# Altium project two_wheel_balance.PrjPcb
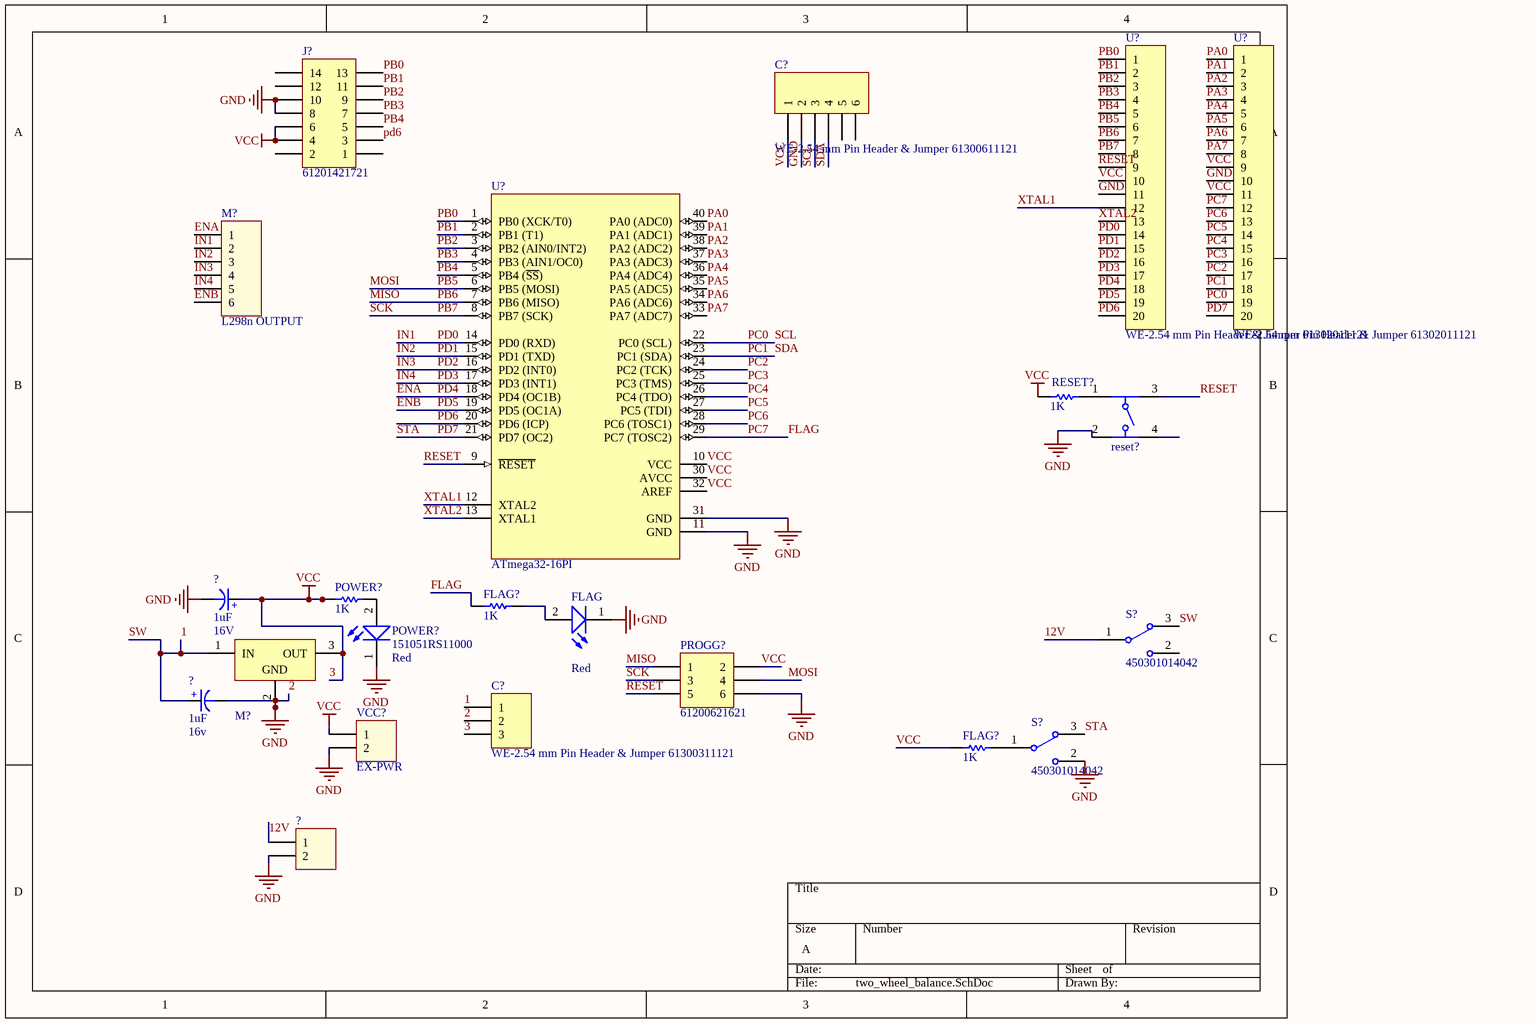
[diagram p0: two_wheel_balance.SchDoc]
1 sheet, 22 parts. Net scope: global (net labels, ports and power ports of the same name join across sheets).
Board file: TWO_WHEEL.PcbDoc

## Sheet two_wheel_balance.SchDoc
size A

### Parts
(Parts that share a designator on the sheet are numbered #1, #2 ... from top to bottom, then left to right.)
?#1  Voltage: 16V  [cap 01]  (hidden comment: 1uF)
?#2  value 1uF  Voltage: 16v  [cap-ele-02.]  (hidden comment: Capacitor_Ele)
?#3  (no value)  [691311500102]
C?#1  WE-2.54 mm Pin Header & Jumper 61300611121  [61300611121]
C?#2  WE-2.54 mm Pin Header & Jumper 61300311121  [61300311121]
FLAG  Emitting Color: Red  [WL-TMRC_5 mm]  (hidden comment: .)
FLAG?#1  1K  [RESC3413X04N]
FLAG?#2  1K  [RESC3413X04N]
J?  61201421721  [61201421721]
M?#1  L298n OUTPUT  [61900611121]
M?#2  7805CV  [TO_220.]  (value not drawn)
POWER?#1  1K  [RESC3413X04N]
POWER?#2  151051RS11000  Emitting Color: Red  [WL-TMRC_5 mm]
PROGG?  61200621621  [61200621621]
RESET?#1  1K  [RESC3413X04N]
reset?#2  (no value)  [4301x60437x6_6x6x4.3]
S?#1  450301014042  [450301014042]
S?#2  450301014042  [450301014042]
U?#1  WE-2.54 mm Pin Header & Jumper 61302011121  [61302011121]
U?#2  WE-2.54 mm Pin Header & Jumper 61302011121  [61302011121]
U?#3  ATmega32-16PI  [40P6]
VCC?  EX-PWR  [61900211121]

### Nets
2: ?#1.2(-) ?#2.2(-) ?#3.2 C?#1.2 C?#2.2 FLAG.1(K) J?.8 J?.10 M?#2.2(GND) POWER?#2.1(K) PROGG?.6 reset?#2.2 S?#2.2 U?#1.11 U?#2.10 U?#3.11(GND) U?#3.31(GND) VCC?.2  [also labelled GND]
3: ?#1.1(+) C?#1.1 C?#2.3 FLAG?#2.1 J?.4 J?.6 M?#2.3(OUT) POWER?#1.1 PROGG?.2 RESET?#1.1 U?#1.10 U?#2.9 U?#2.11 U?#3.10(VCC) U?#3.30(AVCC) U?#3.32(AREF) VCC?.1  [also labelled VCC]
1: ?#2.1(+) C?#2.1 M?#2.1(IN) S?#1.3  [also labelled SW]
12V: ?#3.1 S?#1.1(COM)
ENA: M?#1.1 U?#1.18 U?#3.18(PD4_(OC1B))  [also labelled PD4]
ENB: M?#1.6 U?#1.19 U?#3.19(PD5_(OC1A))  [also labelled PD5]
FLAG: FLAG?#1.1 U?#2.12 U?#3.29(PC7_(TOSC2))  [also labelled PC7]
IN1: M?#1.2 U?#1.14 U?#3.14(PD0_(RXD))  [also labelled PD0]
IN2: M?#1.3 U?#1.15 U?#3.15(PD1_(TXD))  [also labelled PD1]
IN3: M?#1.4 U?#1.16 U?#3.16(PD2_(INT0))  [also labelled PD2]
IN4: M?#1.5 U?#1.17 U?#3.17(PD3_(INT1))  [also labelled PD3]
MISO: PROGG?.1 U?#1.7 U?#3.7(PB6_(MISO))  [also labelled PB6]
MOSI: PROGG?.4 U?#1.6 U?#3.6(PB5_(MOSI))  [also labelled PB5]
PA0: U?#2.1 U?#3.40(PA0_(ADC0))
PA1: U?#2.2 U?#3.39(PA1_(ADC1))
PA2: U?#2.3 U?#3.38(PA2_(ADC2))
PA3: U?#2.4 U?#3.37(PA3_(ADC3))
PA4: U?#2.5 U?#3.36(PA4_(ADC4))
PA5: U?#2.6 U?#3.35(PA5_(ADC5))
PA6: U?#2.7 U?#3.34(PA6_(ADC6))
PA7: U?#2.8 U?#3.33(PA7_(ADC7))
PB0: J?.13 U?#1.1 U?#3.1(PB0_(XCK/T0))
PB1: J?.11 U?#1.2 U?#3.2(PB1_(T1))
PB2: J?.9 U?#1.3 U?#3.3(PB2_(AIN0/INT2))
PB3: J?.7 U?#1.4 U?#3.4(PB3_(AIN1/OC0))
PB4: J?.5 U?#1.5 U?#3.5(PB4_(~{SS}))
PB7: PROGG?.3 U?#1.8 U?#3.8(PB7_(SCK))  [also labelled SCK]
PC0: C?#1.3 U?#2.19 U?#3.22(PC0_(SCL))  [also labelled SCL]
PC1: C?#1.4 U?#2.18 U?#3.23(PC1_(SDA))  [also labelled SDA]
PC2: U?#2.17 U?#3.24(PC2_(TCK))
PC3: U?#2.16 U?#3.25(PC3_(TMS))
PC4: U?#2.15 U?#3.26(PC4_(TDO))
PC5: U?#2.14 U?#3.27(PC5_(TDI))
PC6: U?#2.13 U?#3.28(PC6_(TOSC1))
PD6: J?.3 U?#1.20 U?#3.20(PD6_(ICP))
PD7: S?#2.3 U?#2.20 U?#3.21(PD7_(OC2))  [also labelled STA]
RESET: PROGG?.5 reset?#2.3 U?#1.9 U?#3.9(~{RESET})
XTAL1: U?#1.12 U?#3.12(XTAL2)
XTAL2: U?#1.13 U?#3.13(XTAL1)
NetFLAG?#2_2: FLAG?#2.2 S?#2.1(COM)
NetFLAG_2: FLAG.2(A) FLAG?#1.2
NetPOWER?#1_2: POWER?#1.2 POWER?#2.2(A)
NetRESET?#1_2: RESET?#1.2 reset?#2.1

Not connected (* = marked no-connect by the designer): C?#1 5 6; J? 1 2 12 14; reset?#2 4; S?#1 2

### Library data of the parts
?#1 = Cap-Polar: Polar Capacitor; Designer: Saeid Jorablo; Organazation: ControTec; Value: 1uF; Adding Date: 1387/12/20
?#2 = Capacitor_Ele.: LatestRevisionDate: 17-Jul-2002; LatestRevisionNote: Re-released for DXP Platform.; Publisher: Altium Limited
?#3 = 691311500102: WR-TBL Serie 311 - 5.08 mm Close Vertical PCB Header, 02p; Pitch: 5.08 mm; ComponentLink1Description: Manufacturer; ComponentLink1URL: http://www.we-online.de; ComponentLink2Description: Datasheet; ComponentLink2URL: http://katalog.we-online.de/em/datasheet/6913115001xx.pdf; Part Number: 691311500102; Published Date: Feb. 2017; Publisher: Wurth Elektronik; Pin Number: 02p
C?#1 = WE-2.54 mm Pin Header & Jumper 61300611121: WR-PHD 2.54mm Pin Header; Manufacturer: W¨¹rth Elektronik eiSos GmbH; ComponentLink1 Description: Manufacturer; ComponentLink2 Description: Datasheet; NoPins: 06; Created Date: 22 March 2013; partNo: 61300611121; ComponentLink1URL: http://www.we-online.com; ComponentLink2URL: http://katalog.we-online.de/em/datasheet/6130xx11121.pdf; Created by: Karrer Zheng
C?#2 = WE-2.54 mm Pin Header & Jumper 61300311121: WR-PHD 2.54mm Pin Header; Manufacturer: W¨¹rth Elektronik eiSos GmbH; ComponentLink1 Description: Manufacturer; ComponentLink2 Description: Datasheet; NoPins: 03; Created Date: 22 March 2013; partNo: 61300311121; ComponentLink1URL: http://www.we-online.com; ComponentLink2URL: http://katalog.we-online.de/em/datasheet/6130xx11121.pdf; Created by: Karrer Zheng
FLAG POWER?#2 = 151051RS11000: WL-TMRC THT Mono-color Round Color, 5 mm, Red; Forward Voltage: 2.1 V; Viewing Angle: 60°; Luminous Intensity: 30 mcd; Published Date: Jan 2017; Publisher: Wurth Elektronik; ComponentLink1Description: Manufacturer; ComponentLink1URL: http://www.we-online.de; ComponentLink2Description: Datasheet; ComponentLink2URL: http://katalog.we-online.de/led/datasheet/151051RS11000.pdf; Part Number: 151051RS11000; Size: 5 mm
FLAG?#1 FLAG?#2 POWER?#1 RESET?#1 = RES 0805 0.125W: RES 0805; Designer: Abbas Basereh; Desc.: RES SMD 0805; Data: 16-12-2016
J? = 61201421721: WR-BHD 2.54mm Male Angled Box Header; Manufacturer: Wurth Elektronik; ComponentLink1 Description: Manufacturer; ComponentLink2 Description: Datasheet; NoPins: 14; Created Date: March 2016; partNo: 61201421721; ComponentLink1URL: http://www.we-online.com; ComponentLink2URL: http://katalog.we-online.de/em/datasheet/6120xx21721.pdf; Created by: Baojun Chen
M?#1 = 61900611121: WR-WTB 2.54mm Male Locking Header, 6p; Pin Number: 6; ComponentLink1Description: Manufacturer; ComponentLink1URL: http://www.we-online.de; ComponentLink2Description: Datasheet; ComponentLink2URL: http://katalog.we-online.de/em/datasheet/6190xx11121.pdf; Part Number: 61900611121; Published Date: June 2017; Publisher: Wurth Elektronik; Pitch: 2.54 mm
M?#2 = 7805: LatestRevisionDate: 17-Jul-2002; LatestRevisionNote: Re-released for DXP Platform.; Publisher: Altium Limited
PROGG? = 61200621621: WR-BHD 2.54mm Male Box Header; Manufacturer: Wurth Elektronik; ComponentLink1 Description: Manufacturer; ComponentLink2 Description: Datasheet; NoPins: 6; Created Date: March 2016; partNo: 61200621621; ComponentLink1URL: http://www.we-online.com; ComponentLink2URL: http://katalog.we-online.de/em/datasheet/6120xx21621.pdf; Created by: Baojun Chen
reset?#2 = 430156043736: WS-TATV 6x6mm Tact Switch, THT version; Operation Force: 360g; ComponentLink1Description: Manufacturer; ComponentLink1URL: http://www.we-online.de; ComponentLink2Description: Datasheet; ComponentLink2URL: http://katalog.we-online.de/em/datasheet/4301x6xxx7x6.pdf; Part Number: 430156043736; Published Date: June 2017; Publisher: Wurth Elektronik; Size: 6x6x4.3 mm; Life Cycle: 200000 cycles
S?#1 S?#2 = 450301014042: WS-SLTV 10x2.5 mm THT; ComponentLink1Description: Manufacturer; ComponentLink1URL: http://www.we-online.de; ComponentLink2Description: Datasheet; ComponentLink2URL: http://katalog.we-online.de/em/datasheet/450301014042.pdf; Part Number: 450301014042; Published Date: June 2017; Publisher: Wurth Elektronik
U?#1 U?#2 = WE-2.54 mm Pin Header & Jumper 61302011121: WR-PHD 2.54mm Pin Header; Manufacturer: W¨¹rth Elektronik eiSos GmbH; ComponentLink1 Description: Manufacturer; ComponentLink2 Description: Datasheet; NoPins: 20; ComponentLink1URL: http://www.we-online.com; ComponentLink2URL: http://katalog.we-online.de/em/datasheet/6130xx11121.pdf; Created Date: 22 March 2013; partNo: 61302011121; Created by: Karrer Zheng
U?#3 = ATmega32-16PI: 8-Bit AVR Microcontroller with 32K Bytes of In-System Programmable Flash Memory; Published: 2017-1-4; DatasheetVersion: 2503C-AVR-10/02; PackageVersion: 2017-1-4; PackageReference: 40P6; Publisher: Abbas Basereh; PackageDescription: 40-lead (0.600"/15.24mm Wide) Plastic Dual Inline Package (PDIP); Supplier 1: Digi-Key; Supplier Part Number 1: ATMEGA32-16PI-ND; Supplier 2: Farnell; Supplier Part Number 2: 4376328; Supplier 3: Mouser; Supplier Part Number 3: 556-ATMEGA32-16PI; Code_JEDEC: MS-011-AC; ComponentLink1Description: Datasheet; ComponentLink1URL: http://www.atmel.com/dyn/resources/prod_documents/doc2503.pdf; ComponentLink2Description: Atmel.com Home; ComponentLink2URL: http://www.atmel.com
VCC? = 61900211121: WR-WTB 2.54mm Male Locking Header, 2p; Pin Number: 2; ComponentLink1Description: Manufacturer; ComponentLink1URL: http://www.we-online.de; ComponentLink2Description: Datasheet; ComponentLink2URL: http://katalog.we-online.de/em/datasheet/6190xx11121.pdf; Part Number: 61900211121; Published Date: June 2017; Publisher: Wurth Elektronik; Pitch: 2.54 mm